# Altium schematic sheet HACK_IO-C.SchDoc
size A4
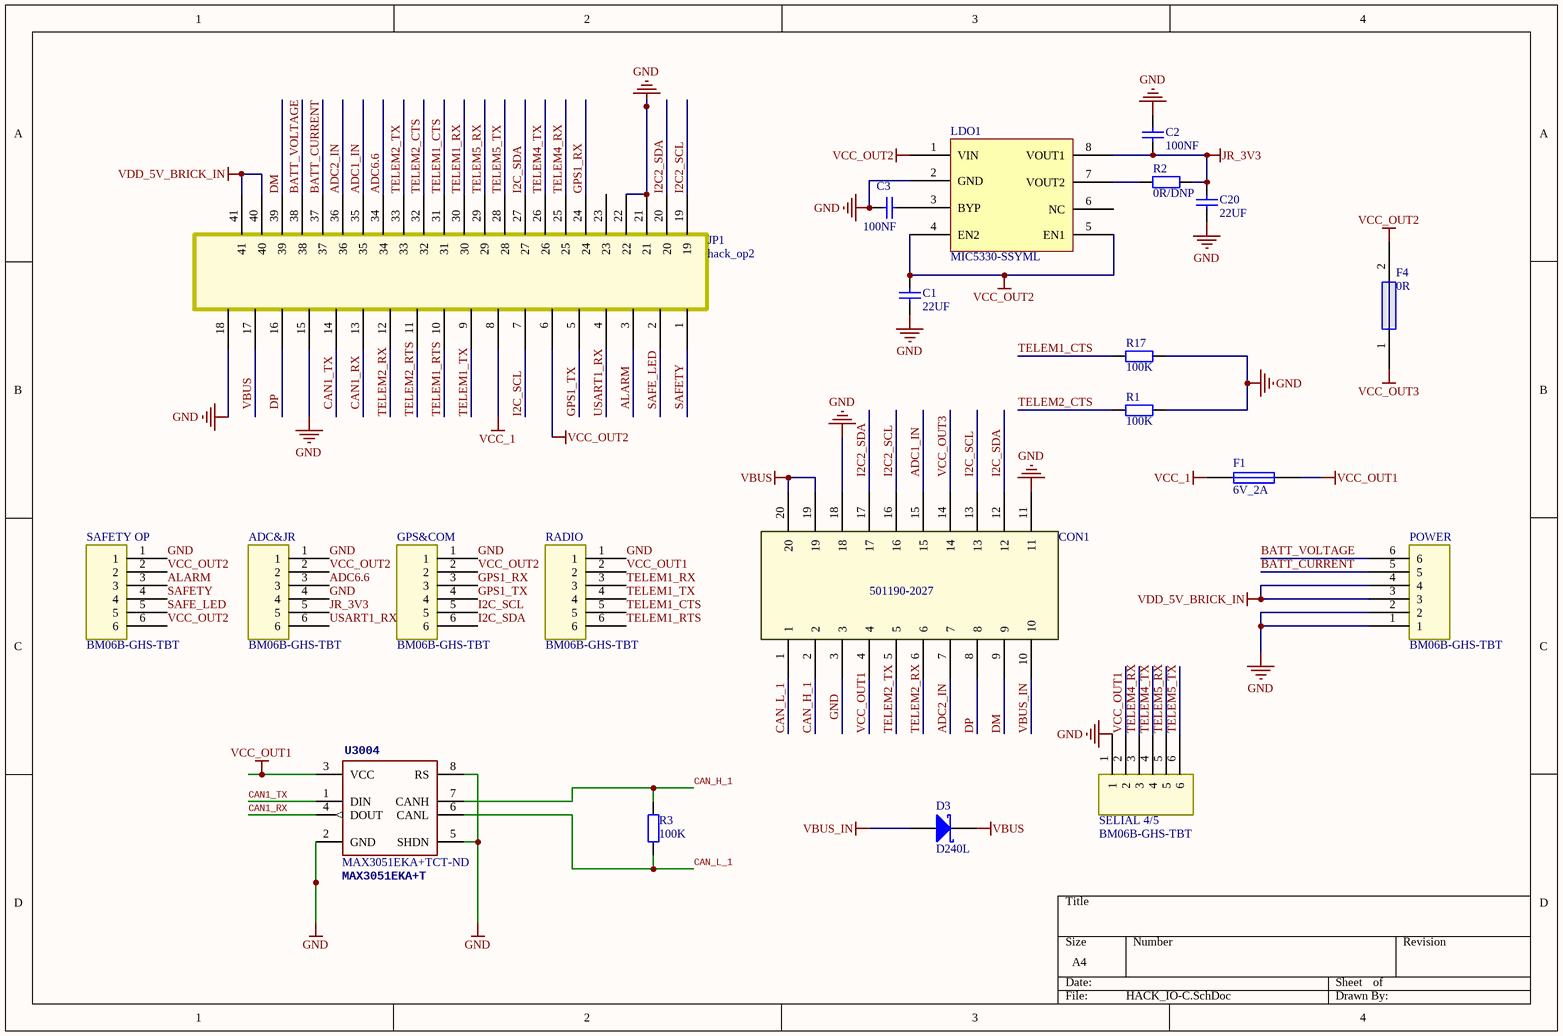
[diagram p0: HACK_IO-C.SchDoc]

## Parts
ADC&JR  BM06B-GHS-TBT  [GH1.25-6]
C1  22UF  [0805CAP]
C2  100NF  [0402CAP]
C3  100NF  [0402CAP]
C20  22UF  [0805CAP]
CON1  501190-2027  [SHD1X20]
D3  D240L  [SOD-123]
F1  6V_2A  [1206fuse]
F4  0R  [KYOCERA-KNH16-DA]
GPS&COM  BM06B-GHS-TBT  [GH1.25-6]
JP1  hack_op2  [hack_op2]
LDO1  MIC5330-SSYML  [MIC5530]
POWER  BM06B-GHS-TBT  [GH1.25-6]
R1  100K  [R0402]
R2  0R/DNP  [R0402]
R3  100K  [R0402]
R17  100K  [R0402]
RADIO  BM06B-GHS-TBT  [GH1.25-6]
SAFETY_OP  BM06B-GHS-TBT  [GH1.25-6]
SELIAL_4/5  BM06B-GHS-TBT  [GH1.25-6]
U3004  MAX3051EKA+T  Supplier Part Number 1: MAX3051EKA+TCT-ND  [SOT23-8]

## Nets
GND: ADC&JR.1 ADC&JR.4 C1.1 C2.1 C3.2 C20.2 CON1.3 CON1.11 CON1.18 GPS&COM.1 JP1.15 JP1.18 JP1.21 JP1.22 LDO1.2(GND) POWER.1 POWER.2 R1.1 R17.1 RADIO.1 SAFETY_OP.1 SELIAL_4/5.1 U3004.2(GND) U3004.5(SHDN) U3004.8(RS)
JR_3V3: ADC&JR.5 C2.2 C20.1 LDO1.8(VOUT1) R2.2
VBUS: CON1.19 CON1.20 D3.2(K) JP1.17
VBUS_IN: CON1.10 D3.1(A)
VCC_1: F1.2 JP1.8
VCC_OUT1: CON1.4 F1.1 RADIO.2 SELIAL_4/5.2 U3004.3(VCC)
VCC_OUT2: ADC&JR.2 C1.2 F4.2 GPS&COM.2 JP1.6 LDO1.1(VIN) LDO1.4(EN2) LDO1.5(EN1) SAFETY_OP.2 SAFETY_OP.6
VCC_OUT3: CON1.14 F4.1
VDD_5V_BRICK_IN: JP1.40 JP1.41 POWER.3 POWER.4
ADC1_IN: CON1.15 JP1.35
ADC2_IN: CON1.7 JP1.36
ADC6.6: ADC&JR.3 JP1.34
ALARM: JP1.3 SAFETY_OP.3
BATT_CURRENT: JP1.37 POWER.5
BATT_VOLTAGE: JP1.38 POWER.6
CAN1_RX: JP1.13 U3004.4(DOUT)
CAN1_TX: JP1.14 U3004.1(DIN)
CAN_H_1: CON1.2 R3.1 U3004.7(CANH)
CAN_L_1: CON1.1 R3.2 U3004.6(CANL)
DM: CON1.9 JP1.39
DP: CON1.8 JP1.16
GPS1_RX: GPS&COM.3 JP1.24
GPS1_TX: GPS&COM.4 JP1.5
I2C2_SCL: CON1.16 JP1.19
I2C2_SDA: CON1.17 JP1.20
I2C_SCL: CON1.13 GPS&COM.5 JP1.7
I2C_SDA: CON1.12 GPS&COM.6 JP1.27
SAFE_LED: JP1.2 SAFETY_OP.5
SAFETY: JP1.1 SAFETY_OP.4
TELEM1_CTS: JP1.31 R17.2 RADIO.5
TELEM1_RTS: JP1.10 RADIO.6
TELEM1_RX: JP1.30 RADIO.3
TELEM1_TX: JP1.9 RADIO.4
TELEM2_CTS: JP1.32 R1.2
TELEM2_RTS: JP1.11
TELEM2_RX: CON1.6 JP1.12
TELEM2_TX: CON1.5 JP1.33
TELEM4_RX: JP1.25 SELIAL_4/5.3
TELEM4_TX: JP1.26 SELIAL_4/5.4
TELEM5_RX: JP1.29 SELIAL_4/5.5
TELEM5_TX: JP1.28 SELIAL_4/5.6
USART1_RX: ADC&JR.6 JP1.4
NetC3_1: C3.1 LDO1.3(BYP)
NetLDO1_7: LDO1.7(VOUT2) R2.1

Not connected (* = marked no-connect by the designer): JP1 23; LDO1 6(NC)

## Library data of the parts
ADC&JR GPS&COM POWER RADIO SAFETY_OP SELIAL_4/5 = GH1.25-6
C1-C3 C20 = Cap: Value: 100pF; Published: 8-Jun-2000; LatestRevisionDate: 17-Jul-2002; LatestRevisionNote: Re-released for DXP Platform.; PackageReference: RAD-0.3; Publisher: Altium Limited; PackageDescription: Radial Cap, Thru-Hole; 2 Leads; 0.3 in Pin Spacing
CON1 = SHD1X20
D3 = D Schottky: Schottky Diode; Published: 8-Jun-2000; LatestRevisionDate: 17-Jul-2002; LatestRevisionNote: Re-released for DXP Platform.; PackageReference: SMB; Publisher: Altium Limited; PackageDescription: DO-214-AA/SMB; 2 C-Bend Leads; Body 5.3 x 3.6 mm, inc. leads (LxW); Code_JEDEC: DO-214-AA
F1 = Fuse 1: Fuse; Published: 8-Jun-2000; LatestRevisionDate: 17-Jul-2002; LatestRevisionNote: Re-released for DXP Platform.; PackageReference: PIN-W2/E2.8; Publisher: Altium Limited; PackageDescription: Thru-Hole; 2 Leads
F4 = KYOCERA-KNH16-DA
LDO1 = MIC5530
R1-R3 R17 = Res2: Resistor; Value: 1K; Published: 8-Jun-2000; LatestRevisionDate: 17-Jul-2002; LatestRevisionNote: Re-released for DXP Platform.; PackageReference: AXIAL-0.4; Publisher: Altium Limited; PackageDescription: Axial Device, Thru-Hole; 2 Leads; 0.4 in Pin Spacing
U3004 = MAX3051MAX3051EKA: IC TXRX CAN 1MBPS SOT23-8; 3DR_PARTNO: ECM0831; Supplier 1: Digi-Key; PARTNO: MAX3051EKA+T; Value: CAN